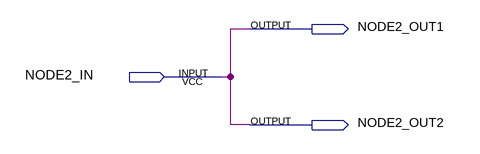
[diagram p0: schematic sheet]
// Quartus schematic NODE2.bdf as structural Verilog: 0 symbols, 3 pins
module NODE2 (
  input  NODE2_IN,
  output NODE2_OUT1,
  output NODE2_OUT2
);


  assign NODE2_OUT1 = NODE2_IN;
  assign NODE2_OUT2 = NODE2_IN;
endmodule
